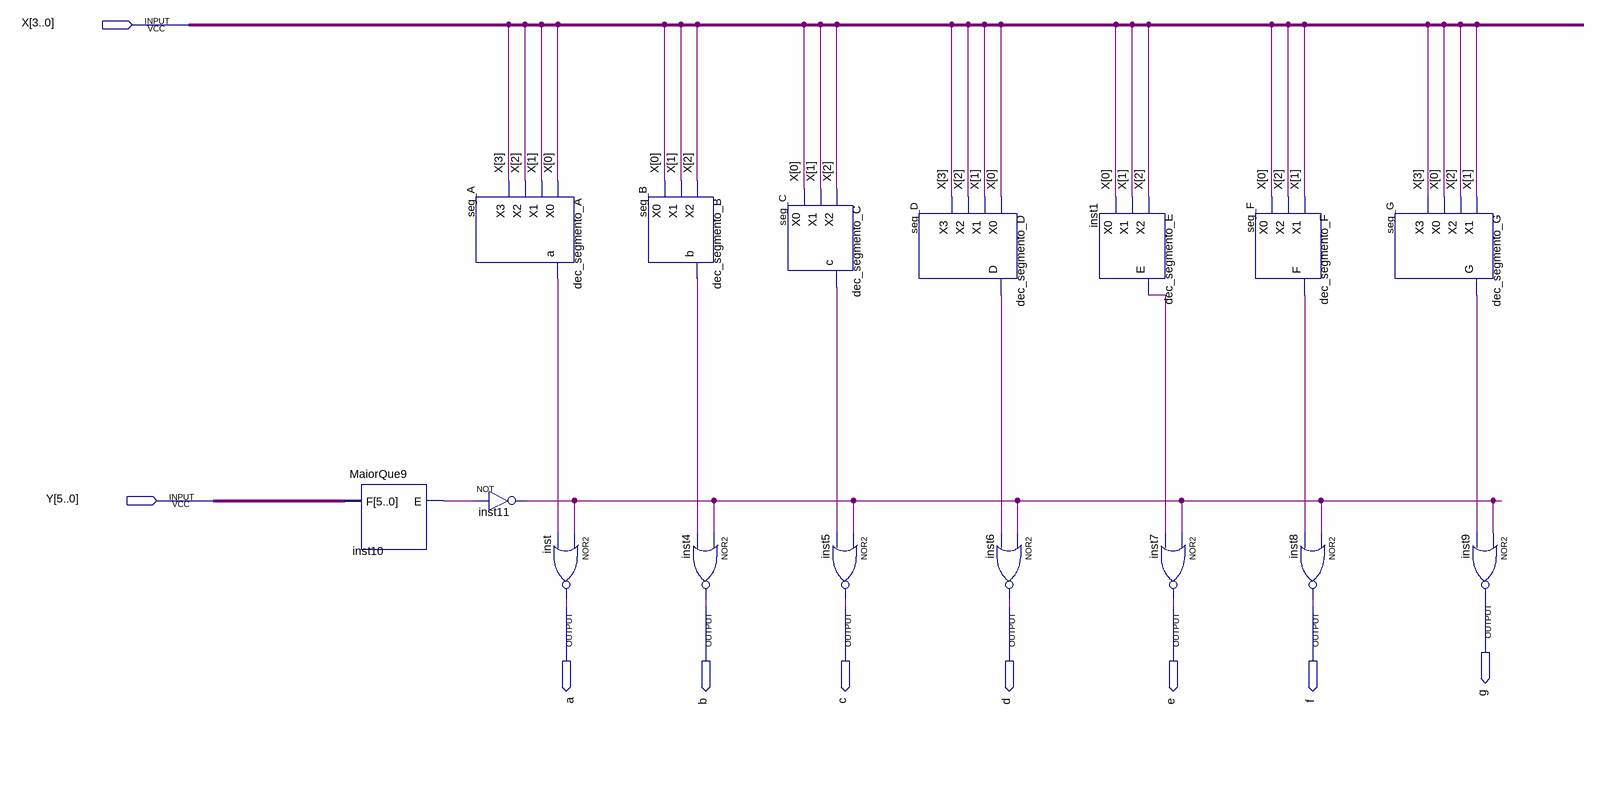
[diagram p0: schematic sheet]
// Quartus schematic SEM_ENABLE.bdf as structural Verilog: 16 symbols, 9 pins
module SEM_ENABLE (
  input  [3:0] X,
  input  [5:0] Y,
  output g,
  output a,
  output b,
  output c,
  output d,
  output e,
  output f
);

  wire inst1_e, inst10_e, inst11_out, seg_A_a, seg_B_b, seg_C_c, seg_D_d, seg_F_f, seg_G_g;

  MaiorQue9 inst10 (.F(Y), .E(inst10_e));
  dec_segmento_A seg_A (.X0(X[0]), .X1(X[1]), .X2(X[2]), .X3(X[3]), .a(seg_A_a));
  not inst11 (inst11_out, inst10_e);
  nor inst (a, inst11_out, seg_A_a);
  dec_segmento_B seg_B (.X2(X[2]), .X1(X[1]), .X0(X[0]), .b(seg_B_b));
  nor inst4 (b, inst11_out, seg_B_b);
  dec_segmento_C seg_C (.X2(X[2]), .X1(X[1]), .X0(X[0]), .c(seg_C_c));
  nor inst5 (c, inst11_out, seg_C_c);
  dec_segmento_D seg_D (.X0(X[0]), .X1(X[1]), .X2(X[2]), .X3(X[3]), .D(seg_D_d));
  nor inst6 (d, inst11_out, seg_D_d);
  dec_segmento_E inst1 (.X2(X[2]), .X1(X[1]), .X0(X[0]), .E(inst1_e));
  nor inst7 (e, inst11_out, inst1_e);
  dec_segmento_F seg_F (.X1(X[1]), .X2(X[2]), .X0(X[0]), .F(seg_F_f));
  nor inst8 (f, inst11_out, seg_F_f);
  dec_segmento_G seg_G (.X1(X[1]), .X2(X[2]), .X0(X[0]), .X3(X[3]), .G(seg_G_g));
  nor inst9 (g, inst11_out, seg_G_g);
endmodule
